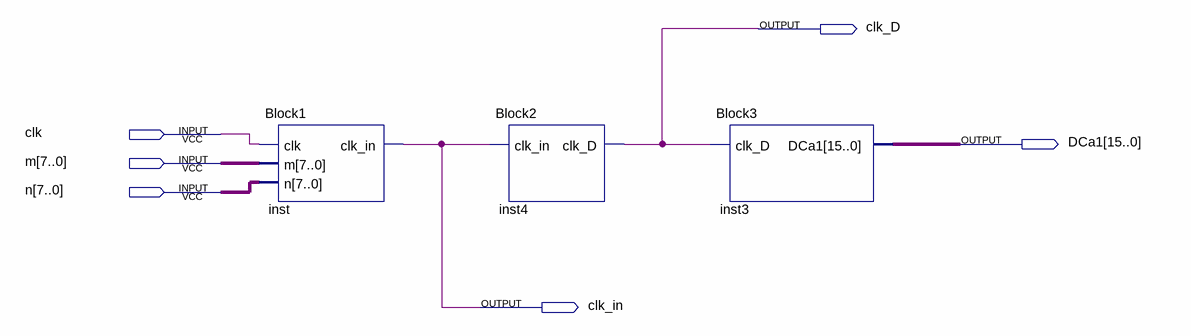
[diagram p0: schematic sheet]
// Quartus schematic laba2.bdf as structural Verilog: 3 symbols, 6 pins
module laba2 (
  input  clk,
  input  [7:0] m,
  input  [7:0] n,
  output clk_D,
  output [15:0] DCa1,
  output clk_in
);

  Block1 inst (.clk(clk), .m(m), .n(n), .clk_in(clk_in));
  Block2 inst4 (.clk_in(clk_in), .clk_D(clk_D));
  Block3 inst3 (.clk_D(clk_D), .DCa1(DCa1));
endmodule
